# EasyEDA Pro project Clock.eprj

# Schematic Schematic1
Board Name: Board1; Create Date: 2025-08-15; Page Name: P1; Project Name: Clock; Schematic Name: Schematic1; Update Date: 2025-08-15; Company: EasyEDA.com; Page Size: A4; Version: V1.0
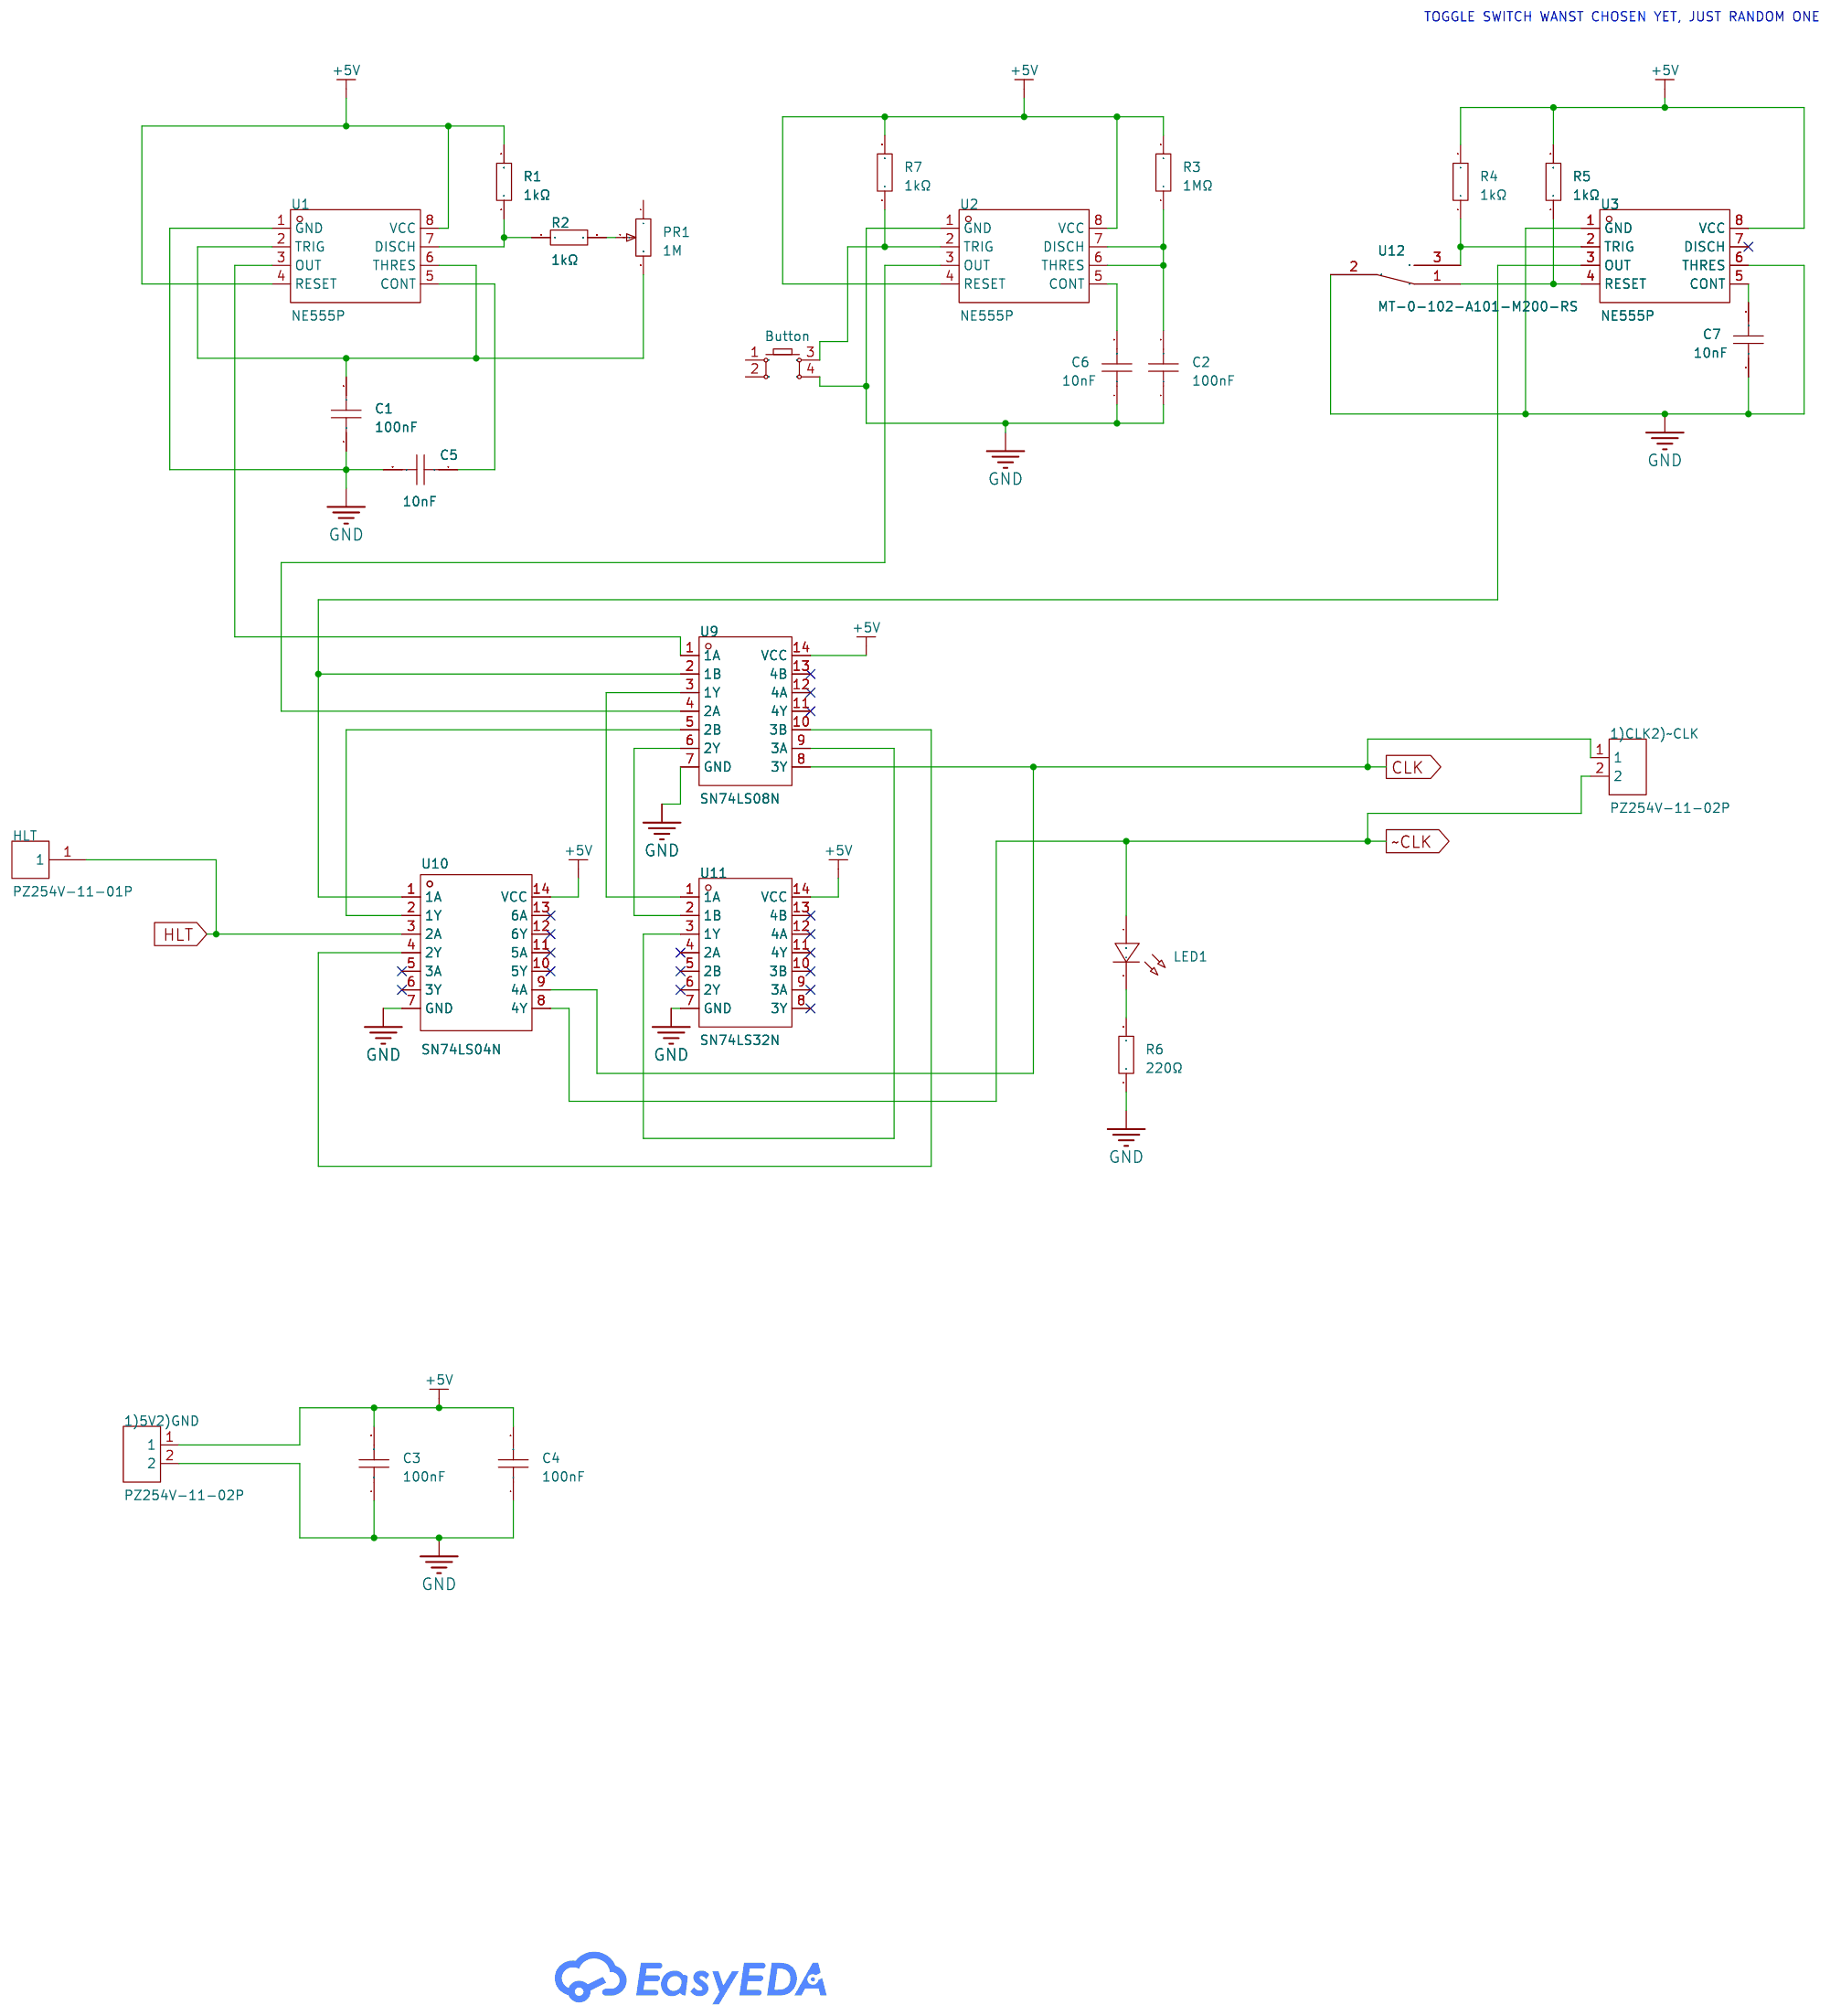
[diagram p0: schematic sheet]

## Parts
1)5V2)GND  PZ254V-11-02P  [HDR-TH_2P-P2.54-V-M]
1)CLK2)~CLK  PZ254V-11-02P  [HDR-TH_2P-P2.54-V-M]
Button  -  [SW-TH_4P-L6.0-W6.0-P4.50-LS6.5]
C1  100nF  [CAP-TH_L8.5-W5.0-P5.00-D1.2]
C2  100nF  [CAP-TH_L8.5-W5.0-P5.00-D1.2]
C3  100nF  [CAP-TH_L8.5-W5.0-P5.00-D1.2]
C4  100nF  [CAP-TH_L8.5-W5.0-P5.00-D1.2]
C5  10nF  [CAP-TH_L8.5-W5.0-P5.00-D1.2]
C6  10nF  [CAP-TH_L8.5-W5.0-P5.00-D1.2]
C7  10nF  [CAP-TH_L8.5-W5.0-P5.00-D1.2]
HLT  PZ254V-11-01P  [HDR-TH_1P-P2.54-V-M]
LED1  -  [LED-TH_BD5.0-P2.54-L-RD_WHITE]
PR1  1M  [RES-ADJ-TH_3P-L10.0-W10.0-P2.50-L]
R1  1kΩ  [R_AXIAL-0.4]
R2  1kΩ  [R_AXIAL-0.4]
R3  1MΩ  [R_AXIAL-0.4]
R4  1kΩ  [R_AXIAL-0.4]
R5  1kΩ  [R_AXIAL-0.4]
R6  220Ω  [R_AXIAL-0.4]
R7  1kΩ  [R_AXIAL-0.4]
U1  NE555P  [DIP-8_L9.8-W6.6-P2.54-LS7.6-BL]
U2  NE555P  [DIP-8_L9.8-W6.6-P2.54-LS7.6-BL]
U3  NE555P  [DIP-8_L9.8-W6.6-P2.54-LS7.6-BL]
U9  SN74LS08N  [PDIP-14_L19.3-W6.4-P2.54-LS7.9-BL-1]
U10  SN74LS04N  [PDIP-14_L19.7-W6.6-P2.54-LS8.3-BL]
U11  SN74LS32N  [PDIP-14_L19.6-W6.5-P2.54-LS7.9-BL]
U12  MT-0-102-A101-M200-RS  [SW-TH_MT-0-103-A101-M200-RS]

## Library data of the parts
1)5V2)GND 1)CLK2)~CLK = PZ254V-11-02P: LCSC Part Name: 1x2P 间距:2.54mm 方针 直插; Supplier Part: C492401; Manufacturer: XFCN(兴飞); Supplier Footprint: 插件,P=2.54mm; JLCPCB Part Class: Extended Part; Datasheet: https://atta.szlcsc.com/upload/public/pdf/source/20200309/C492401_A812433581A9B211A7FFA413ADDFF0E5.pdf; Supplier: LCSC; Pin Structure: 1x2P; Pitch: 2.54mm; Circluar Pins/Square Pins: Policy; Mounting Type: Straight; Number of Rows: Single Row; Number of Pins: 2P; Length of Mating Pin: 6mm; Insulation Height: 2.5mm; Length of End Connection Pin: 3mm; Contact Material: Brass; Operating Temperature: -40℃~+105℃; Color: Black
Button = Key_TH_6x6x6: Supplier Footprint: Through
C1-C7 = CT4-0805B104K500F3: Capacitance:100nF Tolerance:±10% Tolerance:±10% Voltage Rated: Temperature Coefficient:; LCSC Part Name: 100nF ±10% 50V C3型（直脚）; Supplier Part: C84772; Manufacturer: FH(风华); Supplier Footprint: 插件,P=5.08mm; JLCPCB Part Class: Extended Part; Datasheet: https://atta.szlcsc.com/upload/public/pdf/source/20190402/C385200_059806A6312B28FF1421A2413EB641E1.pdf; Supplier: LCSC; Tolerance: ±10%
HLT = PZ254V-11-01P: LCSC Part Name: 1x1P 间距:2.54mm 方针 直插; Supplier Part: C492400; Manufacturer: XFCN(兴飞); Supplier Footprint: 插件,P=2.54mm; JLCPCB Part Class: Extended Part; Datasheet: https://atta.szlcsc.com/upload/public/pdf/source/20200309/C492400_46876A5B545F5AE6B8D4A09C46E276E8.pdf; Supplier: LCSC; Pin Structure: 1x1P; Pitch: 2.54mm; Circluar Pins/Square Pins: Policy; Mounting Type: Straight; Number of Rows: Single Row; Number of Pins: 1P; Length of Mating Pin: 6mm; Insulation Height: 2.5mm; Length of End Connection Pin: 3mm; Contact Material: Brass; Operating Temperature: -40℃~+105℃; Color: Black
LED1 = LED_TH-B_5mm: Supplier Footprint: Through
PR1 = R_3296: Supplier Footprint: Through
R1-R7 = Res_AXIAL-1/4W: Supplier Footprint: Through
U1-U3 = NE555P: Supplier Part: C46749; Manufacturer: TI(德州仪器); Supplier Footprint: DIP-8; JLCPCB Part Class: Extended Part; Datasheet: https://www.ti.com/cn/lit/gpn/ne555; Supplier: LCSC
U9 = SN74LS08N: Logic Type:AND Gate Number of Channels:4 Voltage - Supply:4.75V~5.25V Voltage - Supply:4.75V~5.25V Current - Output Low(IOL):8mA Current - Output High(IOH):400uA Input Logic Level - High:2V Input Logic Level - High:2V Input Logic Level - Low:800mV Input L; Supplier Part: C2869595; Manufacturer: TI(德州仪器); Supplier Footprint: PDIP-14; JLCPCB Part Class: Extended Part; Datasheet: https://www.ti.com/cn/lit/gpn/sn54s08; Supplier: LCSC; Logic Type: AND Gate; Number of Channels: 4; Voltage - Supply: 4.75V~5.25V; Current - Output Low(IOL): 8mA; Current - Output High(IOH): 400uA; Input Logic Level - High: 2V; Input Logic Level - Low: 800mV; Series: 74LSSeries; Operating Temperature: 0℃~+70℃
U10 = SN74LS04N: Voltage - Supply:4.75V~5.25V Voltage - Supply:4.75V~5.25V Number of Circuits:6 Number of Inputs:1 Current - Output Low(IOL):8mA Current - Output High(IOH):400uA Input Logic Level - High:2V Input Logic Level - High:2V Input Logic Level -Low:800mV Input Log; Supplier Part: C183657; Manufacturer: TI(德州仪器); Supplier Footprint: PDIP-14; JLCPCB Part Class: Extended Part; Datasheet: https://www.ti.com/cn/lit/gpn/sn74ls04; Supplier: LCSC; Voltage - Supply: 4.75V~5.25V; Number of Circuits: 6; Number of Inputs: 1; Current - Output Low(IOL): 8mA; Current - Output High(IOH): 400uA; Input Logic Level - High: 2V; Input Logic Level -Low: 800mV; Max Propagation Delay: 15ns@5V,15pF; Series: 74LSSeries; Operating Temperature: 0℃~+70℃
U11 = SN74LS32N: Logic Type:OR Gate Number of Channels:4 Voltage - Supply:4.75V~5.25V Voltage - Supply:4.75V~5.25V Current - Output Low(IOL):8mA Current - Output High(IOH):400uA Input Logic Level - High:2V Input Logic Level - High:2V Input Logic Level - Low:800mV Input Lo; Supplier Part: C273644; Manufacturer: TI(德州仪器); Supplier Footprint: PDIP-14; JLCPCB Part Class: Extended Part; Datasheet: https://www.ti.com/cn/lit/gpn/sn54s32; Supplier: LCSC; Logic Type: OR Gate; Number of Channels: 4; Voltage - Supply: 4.75V~5.25V; Current - Output Low(IOL): 8mA; Current - Output High(IOH): 400uA; Input Logic Level - High: 2V; Input Logic Level - Low: 800mV; Series: 74LSSeries; Propagation Delay: 22ns@5V,15pF; Operating Temperature: 0℃~+70℃
U12 = MT-0-102-A101-M200-RS: Circuit:Single Pole Double Throw (SPDT) Switch Length:13mm Switch Width:8mm Switch Height:28.6mm Mechanical Life:- Contact Current:5A Voltage Rating (AC):125V Actuator Type:Cylinder knob Pin Style:Solder Mounting Style:Direct Insert Operating Temperature:; LCSC Part Name: 小型钮子三脚二档 五件套; Supplier Part: C1788492; Manufacturer: YUEN FUNG(源丰); Supplier Footprint: 插件; JLCPCB Part Class: Extended Part; Datasheet: https://atta.szlcsc.com/upload/public/pdf/source/20230720/8E5C36EFDF374AE4FF4AC09DB233CE0E.pdf; Supplier: LCSC; Circuit: Single Pole Double Throw (SPDT); Switch Length: 13mm; Switch Width: 8mm; Switch Height: 28.6mm; Contact Current: 5A; Voltage Rating (AC): 125V; Actuator Type: Cylinder knob; Pin Style: Solder; Mounting Style: Direct Insert; Operating Temperature: -25℃~+85℃

## Nets
+5V: 1)5V2)GND.1 C3.2 C4.2 R1.2 R3.2 R4.2 R5.2 R7.2 U1.4(RESET) U1.8(VCC) U2.4(RESET) U2.8(VCC) U3.8(VCC) U9.14(VCC) U10.14(VCC) U11.14(VCC)
GND: 1)5V2)GND.2 Button.4 C1.1 C2.1 C3.1 C4.1 C5.2 C6.1 C7.1 R6.1 U1.1(GND) U2.1(GND) U3.1(GND) U3.6(THRES) U9.7(GND) U10.7(GND) U11.7(GND) U12.2
CLK: 1)CLK2)~CLK.1 U9.8(3Y) U10.9(4A)
HLT: HLT.1 U10.3(2A)
~CLK: 1)CLK2)~CLK.2 LED1.1(C) U10.8(4Y)
$1N2479: C1.2 PR1.3 U1.2(TRIG) U1.6(THRES)
$1N2481: PR1.2 R2.2
$1N2482: R1.1 R2.1 U1.7(DISCH)
$1N2483: C5.1 U1.5(CONT)
$1N2484: C2.2 R3.1 U2.6(THRES) U2.7(DISCH)
$1N2488: C7.2 U3.5(CONT)
$1N2489: R5.1 U3.4(RESET) U12.1
$1N2490: R4.1 U3.2(TRIG) U12.3
$1N2493: U1.3(OUT) U9.1(1A)
$1N2494: U2.3(OUT) U9.4(2A)
$1N2495: U9.5(2B) U10.2(1Y)
$1N2496: U3.3(OUT) U9.2(1B) U10.1(1A)
$1N2497: U9.3(1Y) U11.1(1A)
$1N2498: U9.6(2Y) U11.2(1B)
$1N2500: U9.10(3B) U10.4(2Y)
$1N2501: U9.9(3A) U11.3(1Y)
$1N2511: LED1.2(A) R6.2
$1N2512: C6.2 U2.5(CONT)
$1N2513: Button.3 R7.1 U2.2(TRIG)

Not connected (* = marked no-connect by the designer): Button 1 2; PR1 1; U3 7(DISCH)*; U9 11(4Y)* 12(4A)* 13(4B)*; U10 5(3A)* 6(3Y)* 10(5Y)* 11(5A)* 12(6Y)* 13(6A)*; U11 4(2A)* 5(2B)* 6(2Y)* 8(3Y)* 9(3A)* 10(3B)* 11(4Y)* 12(4A)* 13(4B)*

## Notes on the sheet
- TOGGLE SWITCH WANST CHOSEN YET, JUST RANDOM ONE

# Board PCB1
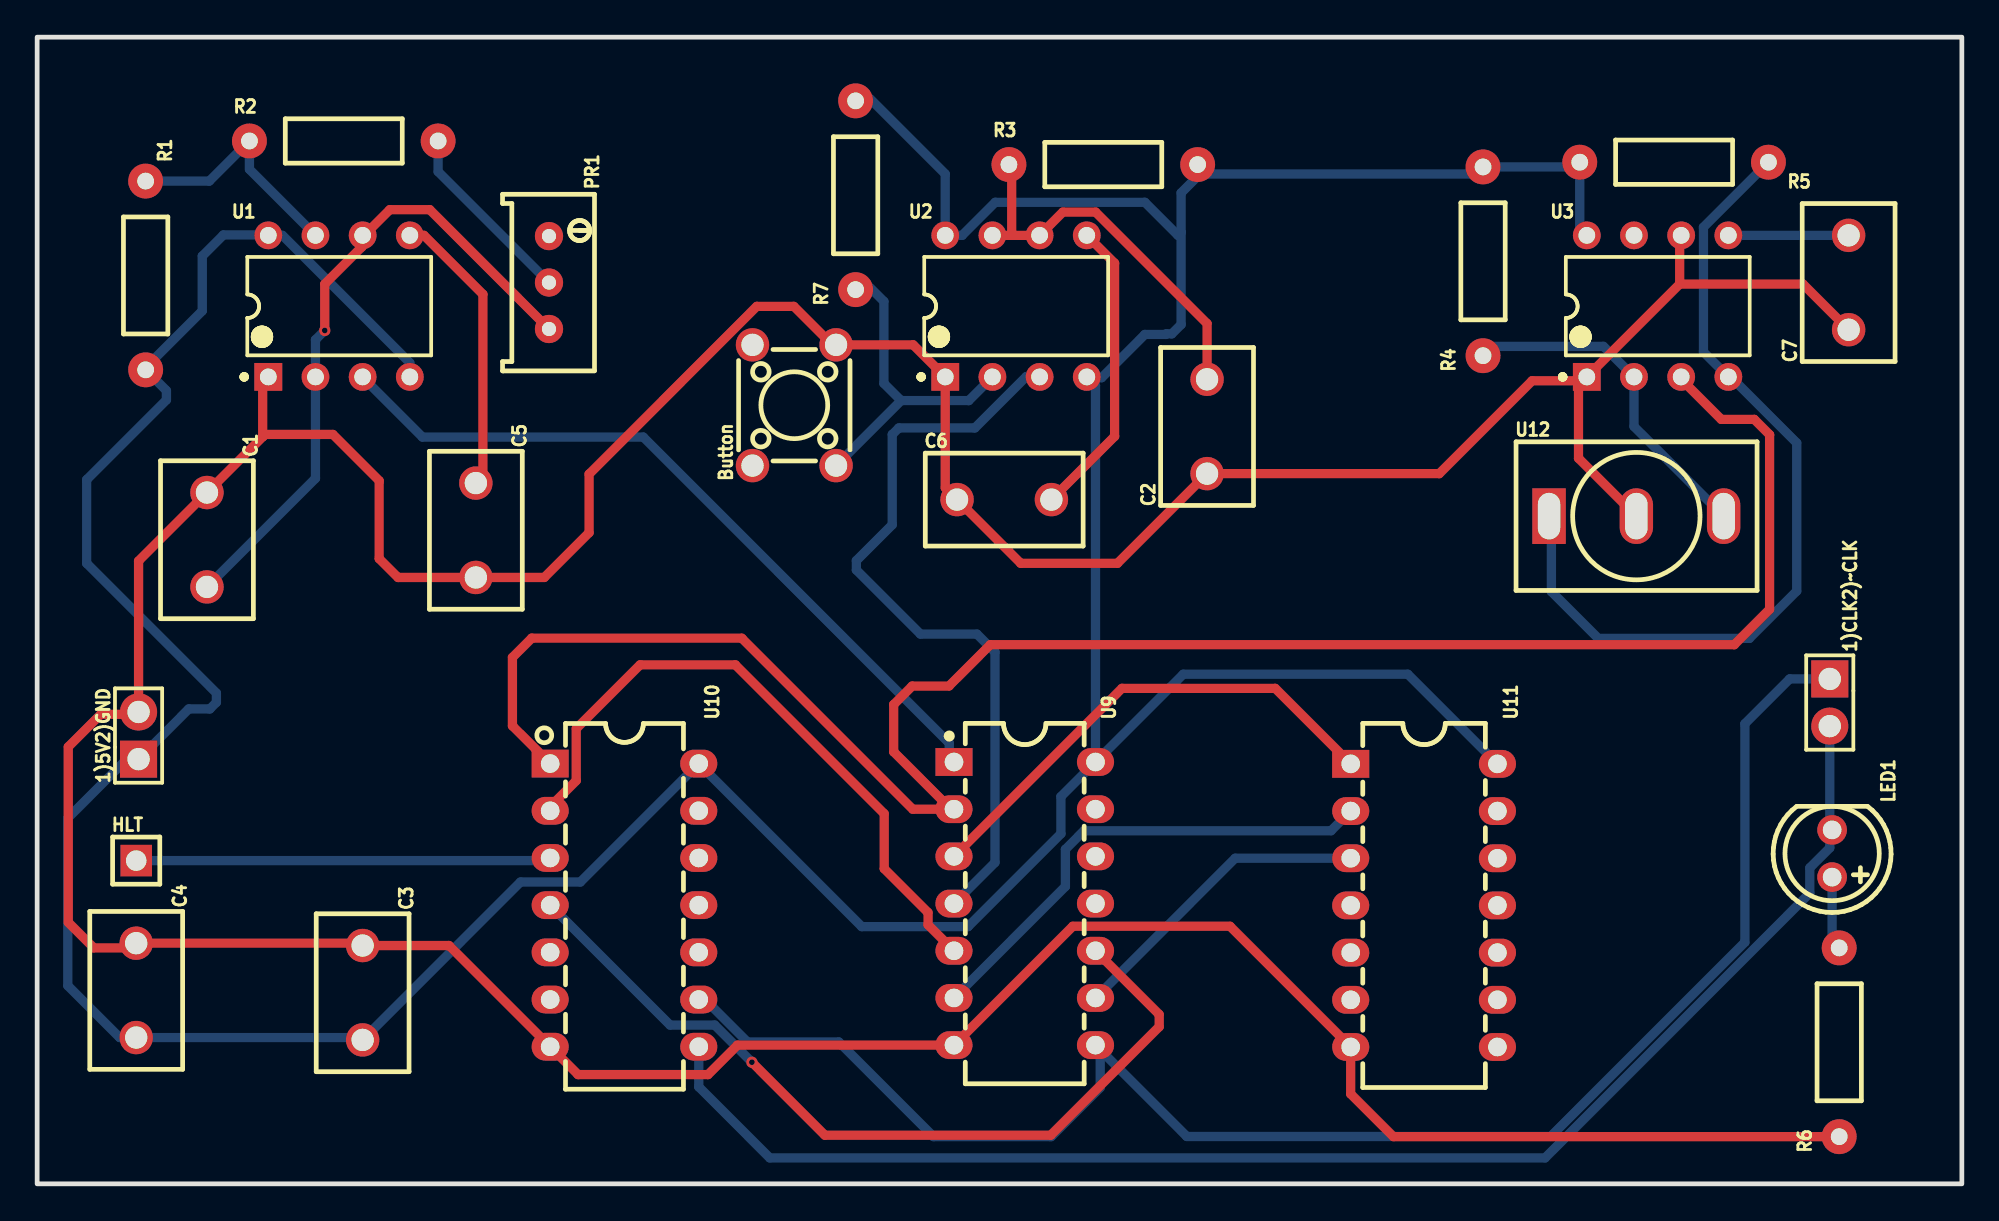
[diagram p1: board, top side]
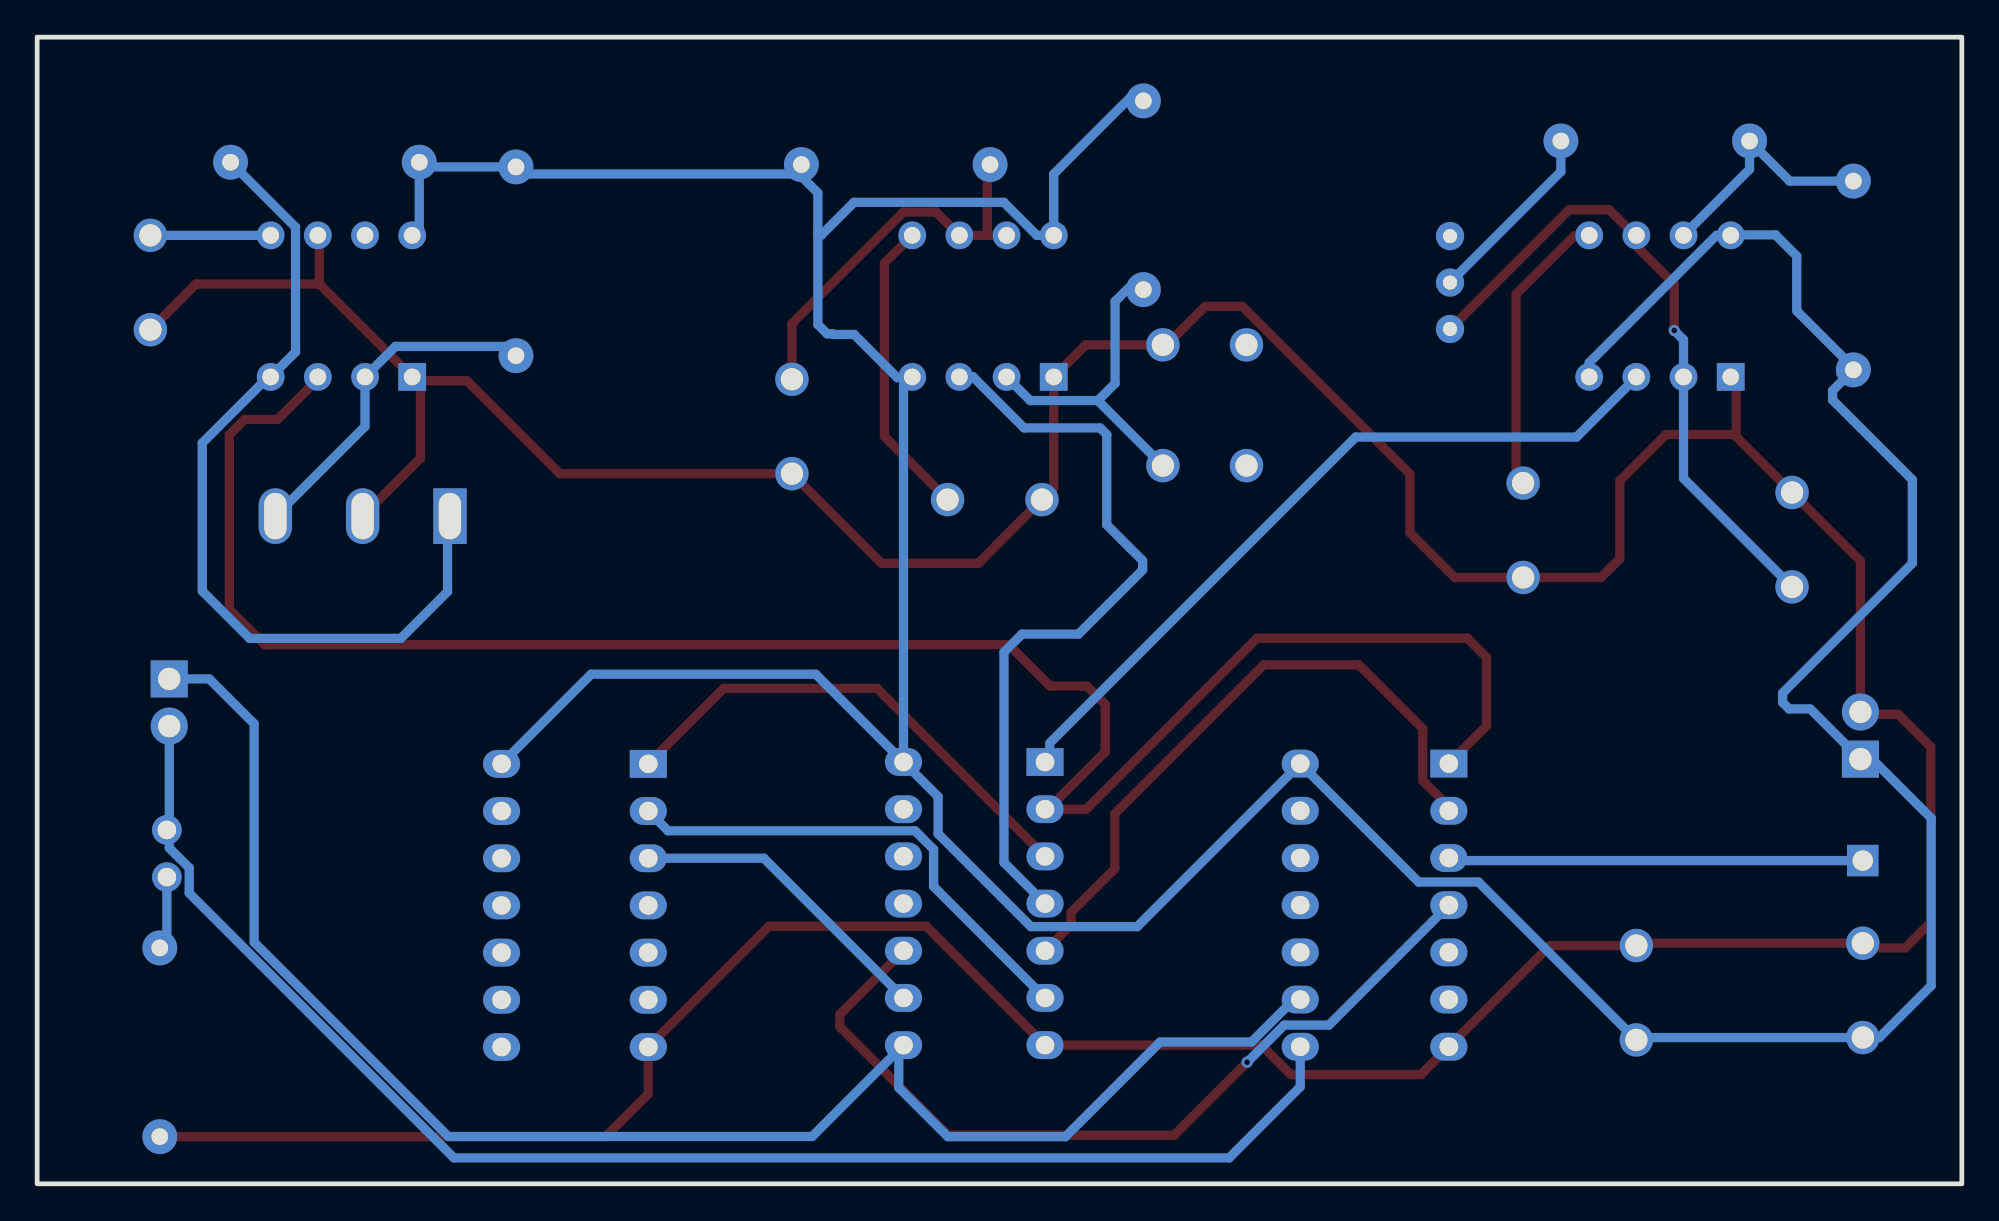
[diagram p2: board, bottom side, seen from below]

Outline 103.63 x 61.72 mm; copper layers: Top Layer, Bottom Layer. Coordinates in mm from the lower left corner of the outline.
Outline path: rectangle 0,61.72 103.63,0
Stack: Top Layer 0.035mm / Dielectric1 1.51mm FR4 er 4.5 / Bottom Layer 0.035mm

## Design rules (mm)
template: Custom Config
spacing copperThickness1oz (default): track to track 0.102, other pairs 0.152 to 0.3
spacing copperThickness2oz: track to track 0.203, other pairs 0.152 to 0.3
track width copperThickness1oz (default): min 0.127, default 0.5, max 2.54
track width copperThickness2oz: min 0.203, default 0.254, max 2.54
differential pair differentialPair (default): width min 0.127, default 0.254, max 2.54; gap min 0.152, default 0.152
via viaSize (default): diameter min 0.5, default 0.61, max 10; hole min 0.3, default 0.305, max 6.3

## Placement (name value [footprint] x y rotation side)
1)5V2)GND  PZ254V-11-02P  [HDR-TH_2P-P2.54-V-M]  5.46 24.13 90 top
1)CLK2)~CLK  PZ254V-11-02P  [HDR-TH_2P-P2.54-V-M]  96.52 25.91 270 top
Button  -  [SW-TH_4P-L6.0-W6.0-P4.50-LS6.5]  40.77 41.91 90 top
C1  100nF  [CAP-TH_L8.5-W5.0-P5.00-D1.2]  9.14 34.67 270 top
C2  100nF  [CAP-TH_L8.5-W5.0-P5.00-D1.2]  62.99 40.77 90 top
C3  100nF  [CAP-TH_L8.5-W5.0-P5.00-D1.2]  17.53 10.29 270 top
C4  100nF  [CAP-TH_L8.5-W5.0-P5.00-D1.2]  5.33 10.41 270 top
C5  10nF  [CAP-TH_L8.5-W5.0-P5.00-D1.2]  23.62 35.18 270 top
C6  10nF  [CAP-TH_L8.5-W5.0-P5.00-D1.2]  52.07 36.83 0 top
C7  10nF  [CAP-TH_L8.5-W5.0-P5.00-D1.2]  97.54 48.51 90 top
HLT  PZ254V-11-01P  [HDR-TH_1P-P2.54-V-M]  5.33 17.4 0 top
LED1  -  [LED-TH_BD5.0-P2.54-L-RD_WHITE]  96.65 17.78 270 top
PR1  1M  [RES-ADJ-TH_3P-L10.0-W10.0-P2.50-L]  27.56 48.51 270 top
R1  1kΩ  [R_AXIAL-0.4]  5.84 48.89 270 top
R2  1kΩ  [R_AXIAL-0.4]  16.51 56.13 0 top
R3  1MΩ  [R_AXIAL-0.4]  57.4 54.86 0 top
R4  1kΩ  [R_AXIAL-0.4]  77.85 49.66 90 top
R5  1kΩ  [R_AXIAL-0.4]  88.14 54.99 180 top
R6  220Ω  [R_AXIAL-0.4]  97.03 7.62 90 top
R7  1kΩ  [R_AXIAL-0.4]  44.07 53.21 90 top
U1  NE555P  [DIP-8_L9.8-W6.6-P2.54-LS7.6-BL]  16.26 47.24 0 top
U2  NE555P  [DIP-8_L9.8-W6.6-P2.54-LS7.6-BL]  52.7 47.24 0 top
U3  NE555P  [DIP-8_L9.8-W6.6-P2.54-LS7.6-BL]  87.25 47.24 0 top
U9  SN74LS08N  [PDIP-14_L19.3-W6.4-P2.54-LS7.9-BL-1]  53.17 15.09 270 top
U10  SN74LS04N  [PDIP-14_L19.7-W6.6-P2.54-LS8.3-BL]  31.62 15 270 top
U11  SN74LS32N  [PDIP-14_L19.6-W6.5-P2.54-LS7.9-BL]  74.68 14.99 270 top
U12  MT-0-102-A101-M200-RS  [SW-TH_MT-0-103-A101-M200-RS]  86.11 35.94 0 top

## Footprints (pads in the part's own frame, mm; a bottom-side part is the same pattern mirrored in y, then rotated)
CAP-TH_L8.5-W5.0-P5.00-D1.2
  round 1.8 hole 1.2: 1(-2.54,0) 2(2.54,0)
DIP-8_L9.8-W6.6-P2.54-LS7.6-BL
  rect 1.5x1.5 hole 0.9: 1(-3.81,-3.81)
  round 1.5 hole 0.9: 2(-1.27,-3.81) 3(1.27,-3.81) 4(3.81,-3.81) 5(3.81,3.81) 6(1.27,3.81) 7(-1.27,3.81) 8(-3.81,3.81)
HDR-TH_1P-P2.54-V-M
  rect 1.7x1.7 hole 1.1: 1(0,0)
HDR-TH_2P-P2.54-V-M
  rect 2x2 hole 1.2: 1(-1.27,0)
  round 2 hole 1.2: 2(1.27,0)
LED-TH_BD5.0-P2.54-L-RD_WHITE
  round 1.6 hole 1: 1(-1.27,0) 2(1.27,0)
PDIP-14_L19.3-W6.4-P2.54-LS7.9-BL-1
  rect 1.5x2 hole 1: 1(-7.62,-3.809)
  oval 1.5x2 hole 1: 2(-5.08,-3.81) 3(-2.54,-3.81) 4(0,-3.81) 5(2.54,-3.81) 6(5.08,-3.81) 7(7.62,-3.81) 8(7.62,3.81) 9(5.08,3.81) 10(2.54,3.81) 11(0,3.81) 12(-2.54,3.81) 13(-5.08,3.81) 14(-7.62,3.81)
PDIP-14_L19.6-W6.5-P2.54-LS7.9-BL
  rect 1.5x2 hole 1: 1(-7.62,-3.95)
  oval 1.5x2 hole 1: 2(-5.08,-3.95) 3(-2.54,-3.95) 4(0,-3.95) 5(2.54,-3.95) 6(5.08,-3.95) 7(7.62,-3.95) 8(7.62,3.95) 9(5.08,3.95) 10(2.54,3.95) 11(0,3.95) 12(-2.54,3.95) 13(-5.08,3.95) 14(-7.62,3.95)
PDIP-14_L19.7-W6.6-P2.54-LS8.3-BL
  rect 1.5x2 hole 1: 1(-7.62,-4)
  oval 1.5x2 hole 1: 2(-5.08,-4) 3(-2.54,-4) 4(0,-4) 5(2.54,-4) 6(5.08,-4) 7(7.62,-4) 8(7.62,4) 9(5.08,4) 10(2.54,4) 11(0,4) 12(-2.54,4) 13(-5.08,4) 14(-7.62,4)
R_AXIAL-0.4
  round 1.879 hole 0.899: 1(-5.08,0) 2(5.08,0)
RES-ADJ-TH_3P-L10.0-W10.0-P2.50-L
  round 1.524 hole 0.762: 1(-2.5,0) 2(0,0) 3(2.5,0)
SW-TH_4P-L6.0-W6.0-P4.50-LS6.5
  round 1.8 hole 1.2: 1(-3.25,2.25) 2(3.25,2.25) 3(-3.25,-2.25) 4(3.25,-2.25)
SW-TH_MT-0-103-A101-M200-RS
  rect 1.8x3 hole 1.2x2.5: 1(-4.7,0)
  oval 1.8x3 hole 1.2x2.5: 2(0,0) 3(4.7,0)

## Nets
As in the schematic.

Pads without a net: Button 1 2; PR1 1; U3 7; U9 11 12 13; U10 5 6 10 11 12 13; U11 4 5 6 8 9 10 11 12 13

## Via types
v1: diameter 0.61, hole 0.305, Top Layer to Bottom Layer, 2 vias

## Routing (per net, layer and track width the routed paths; a pad name or vN(x,y) marks a point on that pad's centre or on a via; arc(x,y) is an arc through that point)
+5V: length 245.8
  Bottom Layer w0.5: 56.55,43.39 56.98,42.96 U9.14 ; 56.55,43.39 57.32,43.39 59.64,45.72 60.77,45.72 60.8,45.75 61.09,45.75 61.59,46.25 61.59,51.22 ; 56.55,43.39 U2.4 ; 61.59,51.22 61.59,53.34 62.61,54.36 77.47,54.36 R4.2 82.8,54.74 83.06,54.99 83.06,51.44 U3.8 ; 61.59,51.22 61.42,51.05 59.65,52.83 51.58,52.83 49.81,51.05 U2.8 48.89,54.36 44.83,58.42 ; U9.14 61.71,27.43 73.8,27.43 U11.14 ; U9.14 55.12,20.84 55.12,18.84 50.12,13.84 44.4,13.84 U10.14 29.25,16.25 26.03,16.25 C3.2 17.4,7.87 C4.2 4.44,7.87 1.65,10.67 1.65,19.69 4.83,22.86 1)5V2)GND.1 8.16,25.56 9.3,25.56 9.65,25.92 9.65,26.42 2.67,33.4 2.67,37.9 6.96,42.2 6.96,42.7 R1.2 5.84,43.94 8.89,46.99 8.89,49.94 10.03,51.08 12.42,51.08 U1.8 13.21,51.05 20.07,44.2 U1.4
GND: length 270.1
  Top Layer w0.5: U3.6 88.44,50.97 88.44,48.43 ; C7.1 95.08,48.43 88.44,48.43 ; U12.2 82.99,39.06 82.99,43.23 ; 88.44,48.43 U3.1 83.23,43.23 82.99,43.23 ; 12.14,40.21 12.14,43.13 U1.1 ; 12.14,40.21 C1.1 5.46,33.53 1)5V2)GND.2 5.33,25.27 3.43,25.27 1.67,23.52 1.67,14.07 3.05,12.7 4.83,12.7 4.95,12.83 5.21,12.83 C4.1 17.4,12.95 C3.1 22.18,12.83 U10.7 29.12,5.88 36.12,5.88 37.71,7.47 U9.7 55.76,13.87 64.23,13.87 U11.7 70.73,4.84 73.02,2.54 R6.1 ; 12.14,40.21 12.27,40.34 15.92,40.34 18.41,37.85 18.41,33.66 19.43,32.64 C5.2 27.3,32.64 29.72,35.05 29.72,38.2 38.75,47.23 40.74,47.23 42.69,45.29 42.89,45.29 Button.4 47.17,45.16 U2.1 48.89,37.47 C6.1 52.96,33.4 58.17,33.4 62.99,38.23 75.49,38.23 80.49,43.23 82.99,43.23
CLK: length 86.5
  Bottom Layer w0.5: 57.24,7.21 57.24,5.18 54.6,2.54 48.26,2.54 43.17,7.63 38.25,7.63 36.34,9.54 36,9.54 U10.9 ; 57.24,7.21 61.9,2.55 81.49,2.55 91.95,13 91.95,24.77 94.36,27.18 1)CLK2)~CLK.1 ; 57.24,7.21 U9.8
HLT: length 22.3
  Bottom Layer w0.5: U10.3 27.48,17.4 HLT.1
~CLK: length 79.1
  Bottom Layer w0.5: 96.52,19.14 LED1.1 ; 96.52,19.14 96.52,18.08 95.45,17.01 95.45,15.65 81.19,1.4 39.45,1.4 35.62,5.22 U10.8 ; 96.52,19.14 1)CLK2)~CLK.2
$1N2479: length 35.7
  Top Layer w0.5: PR1.3 21.14,52.43 18.99,52.43 17.49,50.93 ; 17.49,50.93 17.49,50.43 15.49,48.43 v1(15.49,45.93) ; 17.49,50.93 U1.6
  Bottom Layer w0.5: C1.2 14.99,37.97 U1.2 14.99,45.43 v1(15.49,45.93)
$1N2481: length 10.1
  Bottom Layer w0.5: PR1.2 21.59,54.48 R2.2
$1N2482: length 13
  Bottom Layer w0.5: R1.1 9.27,53.97 R2.1 11.43,54.61 U1.7
$1N2483: length 15.6
  Top Layer w0.5: C5.1 24,38.1 24,47.88 20.83,51.05 U1.5
$1N2484: length 21.4
  Top Layer w0.5: 52.48,51.05 U2.7 ; 52.48,51.05 52.48,54.71 R3.1 ; 52.48,51.05 U2.6 55.23,52.31 56.99,52.31 62.99,46.31 C2.2
$1N2488: length 6.5
  Bottom Layer w0.5: C7.2 U3.5
$1N2489: length 46.1
  Bottom Layer w0.5: R5.1 89.72,51.49 89.72,44.78 U3.4 91.19,43.43 94.74,39.88 94.74,31.91 92.19,29.36 84.05,29.36 81.53,31.88 81.53,35.81 U12.1
$1N2490: length 18.5
  Bottom Layer w0.5: 90.81,35.94 85.98,40.77 U3.2 84.34,45.08 78.35,45.08 R4.1
$1N2493: length 40.9
  Bottom Layer w0.5: U9.1 49.11,22.96 49.11,23.72 32.64,40.2 20.75,40.2 17.53,43.42 U1.3
$1N2494: length 41.1
  Bottom Layer w0.5: U9.4 51.57,17.3 51.57,28.62 50.6,29.59 47.56,29.59 44.11,33.04 44.11,33.54 46.04,35.48 46.04,40.33 46.39,40.69 50.49,40.69 53.25,43.45 53.96,43.45 U2.3
$1N2495: length 35.3
  Top Layer w0.5: U10.2 27.62,20.3 29.02,21.7 29.02,24.5 32.46,27.94 37.6,27.94 45.61,19.92 45.61,16.96 47.97,14.6 47.97,13.94 U9.5
$1N2496: length 106.2
  Top Layer w0.5: 48.82,20.17 48.89,20.23 48.89,20.48 46.12,23.25 46.12,25.8 47.11,26.8 49.1,26.8 51.32,29.02 91.38,29.02 93.28,30.92 93.28,40.32 92.46,41.15 90.68,41.15 88.52,43.31 U3.3 ; 48.82,20.17 U9.2 ; 48.82,20.17 47.14,20.17 37.94,29.37 26.63,29.37 25.59,28.34 25.59,24.65 U10.1
$1N2497: length 26.8
  Top Layer w0.5: U9.3 58.41,26.67 66.66,26.67 U11.1
$1N2498: length 26.7
  Bottom Layer w0.5: U9.6 55.36,16.01 55.36,18.01 56.36,19.01 69.67,19.01 U11.2
$1N2500: length 45.8
  Top Layer w0.5: v1(38.48,6.55) 42.41,2.62 54.57,2.62 60.41,8.46 60.41,9.12 U9.10
  Bottom Layer w0.5: v1(38.48,6.55) 36.48,8.55 34.08,8.55 U10.4
$1N2501: length 16.9
  Bottom Layer w0.5: U11.3 64.5,17.53 U9.9
$1N2511: length 4
  Bottom Layer w0.5: R6.2 96.65,13.08 LED1.2
$1N2512: length 16.3
  Top Layer w0.5: C6.2 58.02,40.23 58.02,49.55 U2.5
$1N2513: length 17.2
  Bottom Layer w0.5: 44.83,48.26 45.59,47.5 45.59,43.08 46.52,42.16 ; U2.2 50.16,42.16 46.52,42.16 ; Button.3 46.52,42.16
